# EAGLE design noroshi_LoRa_RAK (EAGLE 8.6.3)
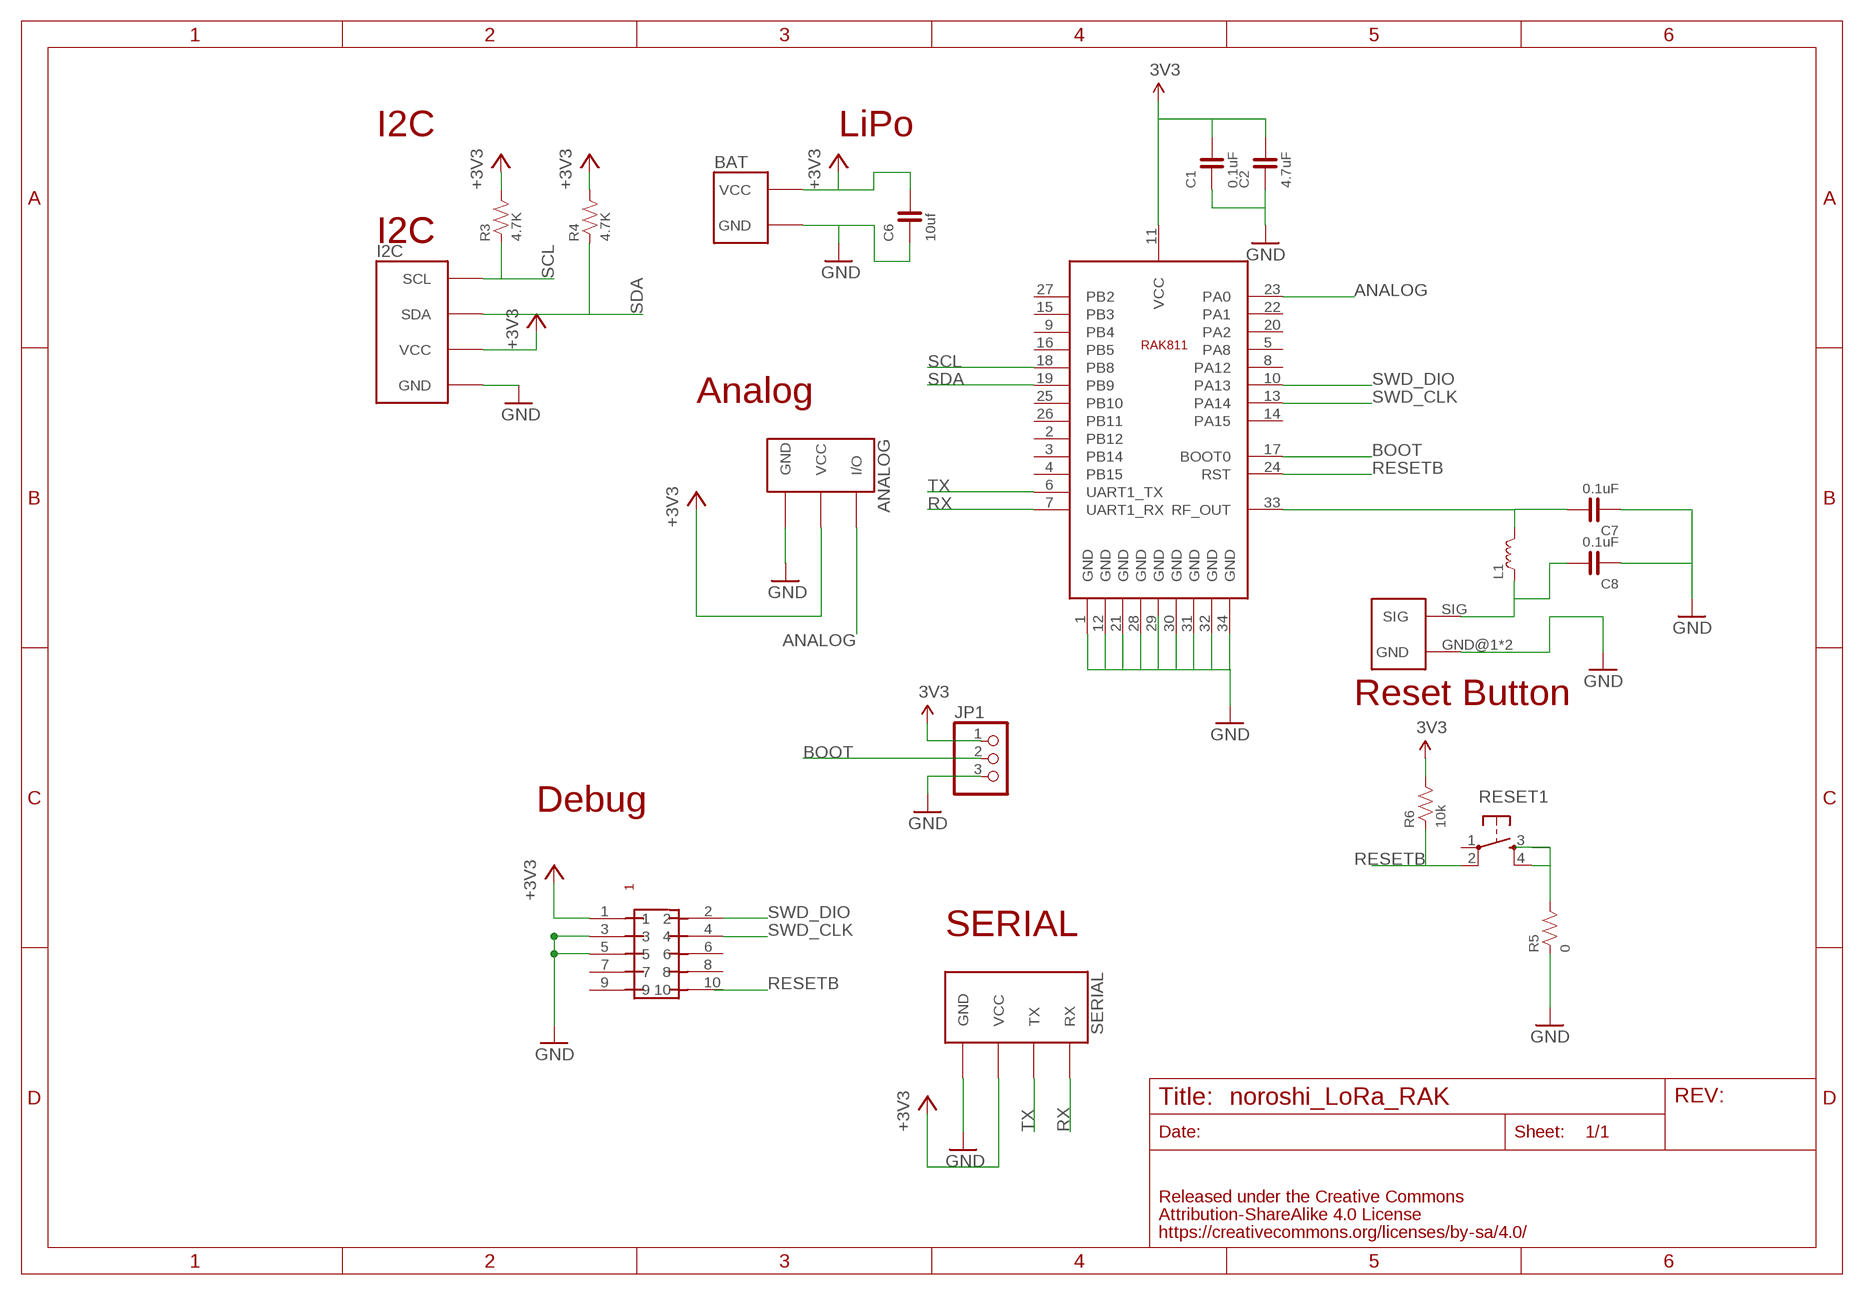
[diagram p0: schematic, sheet 1]

## Parts
ANALOG  FABO_BRICK_3PIN-S03B-PASK-2_LONG  [FABO_BRICK_3PIN_S03B-PASK-2_LONG]
BAT  FABO_BRICK_2PIN_SIDE  [FABO_BRICK_2PIN_S02B−PASK-2_SILK]
C1  0.1uF  CAPACITOR-0603_NARROW  [0603-NARROW]
C2  4.7uF  CAPACITOR-0603_NARROW  [0603-NARROW]
C6  10uf  CAPACITOR-0603  [0603]
C7  0.1uF  CAPACITOR-0603_NARROW  [0603-NARROW]
C8  0.1uF  CAPACITOR-0603_NARROW  [0603-NARROW]
I2C  FABO_BRICK_I2C-S04B-PASK-2_LONG  [FABO_BRICK_I2C_S04B-PASK-2_LONG]
JP1  PINHD-1X3  [1X03]
L1  COIL-0603  [0603]
R3  4.7K  RESISTOR-0603  [0603]
R4  4.7K  RESISTOR-0603  [0603]
R5  0  RESISTOR-0603-NARROW  [0603-NARROW]
R6  10k  RESISTOR-0603-NARROW  [0603-NARROW]
RESET1  TACT-SWITCH-SMD_KMR2  [KMR2]
SERIAL  FABO_BRICK_SERIAL-S04B-PASK-2_LONG  [FABO_BRICK_SERIAL_S04B-PASK-2_LONG]
U$2  RAK811  [RAK811]
U$8  PIN-HEADER-SMT(1.27MM)2X5  [PIN-HEADER-SMT(1.27MM)2X5]
UF1  HIROSE-U.FL  [HIROSE-UF.L]

## Nets
3V3: C1.2 C2.2 JP1.1 R6.2 U$2.11(VCC)
+3V3: ANALOG.VCC BAT.VCC C6.2 I2C.VCC R3.2 R4.2 SERIAL.VCC U$8.1
ANALOG: ANALOG.I/O U$2.23(PA0)
BOOT: JP1.2 U$2.17(BOOT0)
GND: ANALOG.GND BAT.GND C1.1 C2.1 C6.1 C7.1 C8.1 I2C.GND JP1.3 R5.1 SERIAL.GND U$2.1(GND) U$2.12(GND) U$2.21(GND) U$2.28(GND) U$2.30(GND) U$2.31(GND) U$2.32(GND) U$2.34(GND) U$8.3 U$8.5 UF1.GND@1(GND) UF1.GND@2(GND)
N$2: C7.2 L1.2 U$2.33(RF_OUT)
N$3: C8.2 L1.1 UF1.SIG
N$10: R5.2 RESET1.3 RESET1.4
RESETB: R6.1 RESET1.2 U$2.24(RST) U$8.10
RX: SERIAL.RX U$2.7(UART1_RX)
SCL: I2C.SCL R3.1 U$2.18(PB8)
SDA: I2C.SDA R4.1 U$2.19(PB9)
SWD_CLK: U$2.13(PA14) U$8.4
SWD_DIO: U$2.10(PA13) U$8.2
TX: SERIAL.TX U$2.6(UART1_TX)
Unconnected: RESET1.1 U$2.2(PB12) U$2.3(PB14) U$2.4(PB15) U$2.5(PA8) U$2.8(PA12) U$2.9(PB4) U$2.14(PA15) U$2.15(PB3) U$2.16(PB5) U$2.20(PA2) U$2.22(PA1) U$2.25(PB10) U$2.26(PB11) U$2.27(PB2) U$2.29(GND) U$8.6 U$8.7 U$8.8 U$8.9

## Notes on the sheet
- I2C | LiPo
- I2C | I2C
- Analog
- Reset Button
- Debug
- SERIAL

## Library data of the parts
ANALOG = FaBo-Template:FABO_BRICK_3PIN: FaBo Brick 3pin
BAT = FaBo-Template:FABO_BRICK_2PIN
C1 C2 C6-C8 = FaBo-Capacitor:CAPACITOR: CAPACITOR
I2C = FaBo-Template:FABO_BRICK_I2C: FaBo Brick I2C
JP1 = adafruit:PINHD-1X3: PIN HEADER
L1 = FaBo-Coil:COIL: RESISTOR
R3-R6 = FaBo-Resistors:RESISTOR: RESISTOR
RESET1 = FaBo-Switch:TACT-SWITCH
SERIAL = FaBo-Template:FABO_BRICK_SERIAL: FaBo Brick Serial
U$2 = FaBo-LoRa:RAK811
U$8 = gclue:PIN-HEADER-SMT(1.27MM)2X5: PIN-HEADER-SMT (1.27MM) 2x5
UF1 = FaBo-Connetor:HIROSE-U.FL

## Board
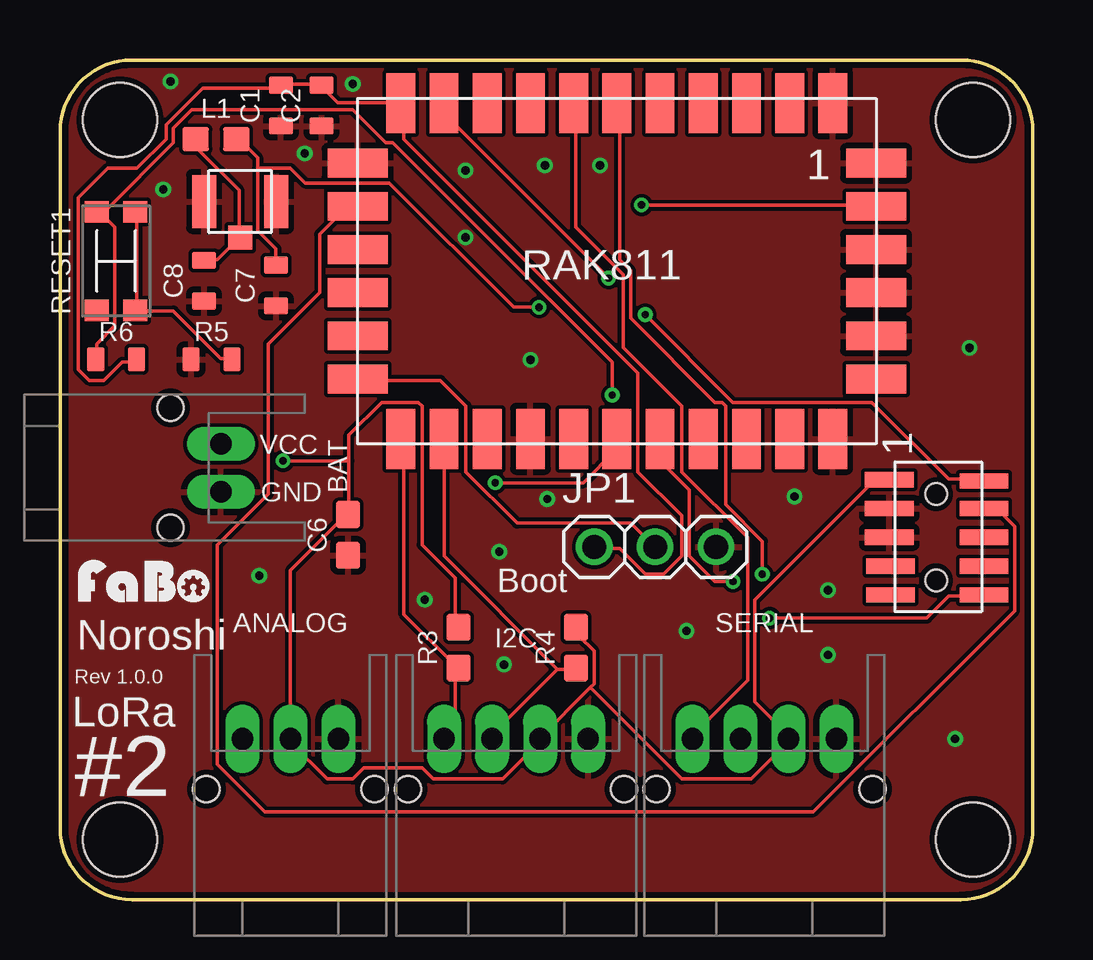
[diagram p1: board, top side]
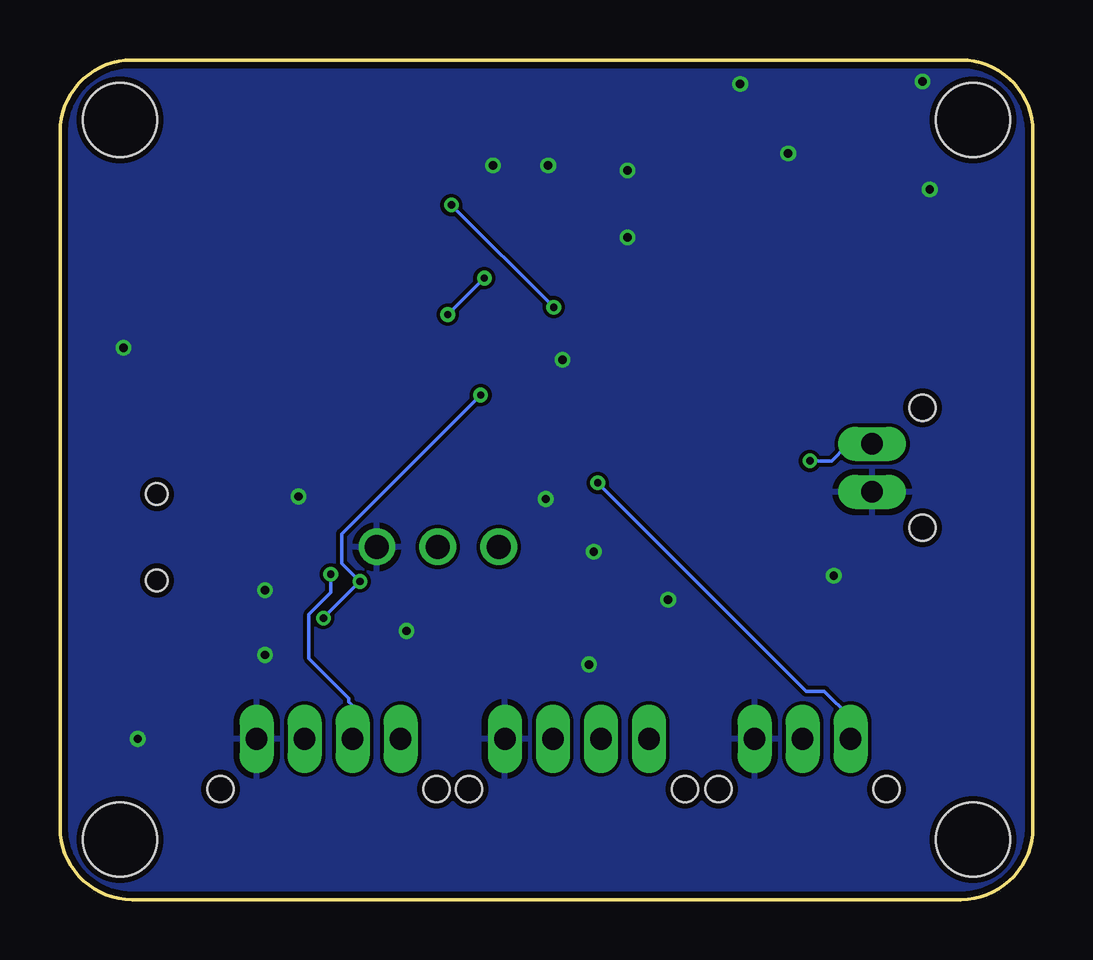
[diagram p2: board, bottom side, seen from below]

Size 40.54 x 35 mm. Coordinates in mm from the lower left corner, seen from the top.
Copper layers (1*16): Top 0.035mm / dielectric 1.5mm / Bottom 0.035mm
Design rules "SeeedStudio_2layer_DRU_no_angle_20140221": minimum track width 6mil, minimum drill 12mil, track to track 6mil, track to pad 6mil, pad to pad 6mil, via to via 6mil, smd to smd 0mil, copper to edge 10mil, drill to drill 10mil, minimum pad ring 10mil, minimum via ring 6mil, stop-mask expansion 2mil, vias tented up to drill 100mil, thermal gap 10mil

### Footprints (pad centres in the part's own frame; a part is rotated, then mirrored left to right if it is on the bottom)
FABO_BRICK_3PIN_S03B-PASK-2_LONG = drill 0.9 pad 1.422 long: GND -2,0; I/O 2,0; VCC 0,0 | hole 1.1: 3.5,2.1; -3.5,2.1
FABO_BRICK_2PIN_S02B−PASK-2_SILK = drill 0.9 pad 1.422 long: GND -1,-0.102; VCC 1,-0.102 | hole 1.1: 2.5,1.998; -2.5,1.998
0603-NARROW = smd 0.71 x 1: 1 -0.85,0; 2 0.85,0
0603 = smd 1.1 x 1: 1 -0.85,0; 2 0.85,0
FABO_BRICK_I2C_S04B-PASK-2_LONG = drill 0.9 pad 1.422 long: GND -3,0; SCL 3,0; SDA 1,0; VCC -1,0 | hole 1.1: 4.5,2.1; -4.5,2.1
1X03 = drill 1.016: 1 -2.54,0; 2 0,0; 3 2.54,0
KMR2 = smd 0.9 x 1: 1 -2.05,0.8; 2 2.05,0.8; 3 2.05,-0.8; 4 -2.05,-0.8
FABO_BRICK_SERIAL_S04B-PASK-2_LONG = drill 0.9 pad 1.422 long: GND -3,0; RX 3,0; TX 1,0; VCC -1,0 | hole 1.1: 4.5,2.1; -4.5,2.1
FABO-SHINOBI = hole 3.1: 2.5,32.5; 38.04,32.5; 38.04,2.5; 2.5,2.5
RAK811 = smd 1.2 x 2.5: 1 -9,-7; 2 -7.2,-7; 3 -5.4,-7; 4 -3.6,-7; 5 -1.8,-7; 6 0,-7; 7 1.8,-7; 8 3.6,-7; 9 5.4,-7; 10 7.2,-7; 11 9,-7; 18 9,7; 19 7.2,7; 20 5.4,7; 21 3.6,7; 22 1.8,7; 23 0,7; 24 -1.8,7; 25 -3.6,7; 26 -5.4,7; 27 -7.2,7; 28 -9,7 | smd 2.5 x 1.2: 12 10.8,-4.5; 13 10.8,-2.7; 14 10.8,-0.9; 15 10.8,0.9; 16 10.8,2.7; 17 10.8,4.5; 29 -10.8,4.5; 30 -10.8,2.7; 31 -10.8,0.9; 32 -10.8,-0.9; 33 -10.8,-2.7; 34 -10.8,-4.5
PIN-HEADER-SMT(1.27MM)2X5 = smd 0.635 x 2.032: 1 -2.4,-1.95; 2 -2.35,2; 3 -1.2,-1.95; 4 -1.2,2; 5 0,-1.95; 6 0,2; 7 1.2,-1.9; 8 1.2,2; 9 2.4,-1.9; 10 2.4,2 | hole 0.9: 1.8,0; -1.8,0
HIROSE-UF.L = smd 1 x 2.2: GND@1 -1.5,0; GND@2 1.5,0 | smd 1 x 1: SIG 0,-1.5

### Placement (x,y rotation side)
ANALOG  9.6,6.7 180 top
BAT  6.6,18 90 top
C1  9.2,33.1 90 top
C2  10.9,33.1 90 top
C6  12,15.2 90 top
C7  9,25.6 90 top
C8  6,25.8 90 top
I2C  19,6.7 180 top
JP1  24.8,14.7 0 top
L1  6.5,31.7 0 top
R3  16.6,10.5 90 top
R4  21.5,10.5 90 top
R5  6.31,22.52 0 top
R6  2.34,22.52 0 top
RESET1  2.34,26.62 90 top
SERIAL  29.35,6.7 180 top
U$1  [FABO-SHINOBI]  0,0 0 top
U$2  23.2,26.2 180 top
U$3  [LOGO_FABO_S]  3.55,12.25 0 top
U$8  36.5,15.1 270 top
UF1  7.5,29.1 0 top

### Tracks (layer width: path | path; a pad name or v marks a point on that pad's centre or on a via)
3V3
  Top 0.152: R6.2 3.05,22.4 2.59,22.4 1.83,21.64 1.22,21.64 0.76,22.1 0.76,29.26 1.98,30.48 3.2,30.48 4.42,31.7 4.42,32.31 5.94,33.83 9.14,33.83 C1.2 9.3,33.98 10.82,33.98 C2.2 10.97,33.83 11.58,33.22 14.17,33.22 U$2.11 14.33,33.07 14.33,31.7 24.08,21.95 24.08,17.83 25.91,16 25.91,14.33 25.15,13.56 24.38,13.56 23.32,14.63 22.4,14.63 JP1.1
+3V3  (via drill 0.3)
  Top 0.152: 12.04,18.29 12.04,16.15 C6.2 11.89,16 9.6,13.72 ANALOG.VCC 9.6,6.55 11.12,5.03 12.19,5.03 12.65,5.49 15.09,5.49 15.54,5.03 18.44,5.03 19.96,6.55 I2C.VCC 19.96,6.71 22.1,8.84 | 12.04,18.29 12.04,19.36 13.41,20.73 14.94,20.73 15.09,20.57 15.09,14.78 16.46,13.41 16.46,11.43 R3.2 | 12.04,18.29 v9.3,18.29 | 22.1,8.84 22.25,8.99 22.25,10.36 21.64,10.97 21.64,11.28 R4.2 | U$8.1 34.44,17.37 33.83,17.37 28.96,12.5 28.96,8.23 30.48,6.71 SERIAL.VCC 30.33,6.55 28.8,5.03 25.91,5.03 22.1,8.84
  Bottom 0.152: v9.3,18.29 8.38,18.29 7.77,18.9 6.71,18.9 BAT.VCC
ANALOG  (via drill 0.3)
  Top 0.152: v18.14,17.37 21.79,17.37 23.16,18.75 23.16,19.05 U$2.23
  Bottom 0.152: v18.14,17.37 9.45,8.69 8.69,8.69 7.62,7.62 7.62,6.71 ANALOG.I/O
BOOT
  Top 0.152: U$2.17 12.5,21.64 15.85,21.64 16.92,20.57 16.92,17.83 19.05,15.7 23.77,15.7 24.69,14.78 JP1.2
GND  (via drill 0.35)
  other vias: 8.3,13.5 18.3,14.5 20.3,16.7 20.2,30.6 22.5,30.6 16.9,30.4 12.2,34 4.6,34.1 26.1,11.2 19.6,22.5 18.5,9.8 15.2,12.5 37.9,23 32,12.9 32,10.2 37.3,6.7 30.6,16.8 4.3,29.6 10.2,31.1 16.9,27.6
  pour Bottom: 0,0 0,35.56 40.64,35.56 40.64,0
  pour Top: -0.1,-0.1 -0.1,35.56 40.64,35.56 40.64,0 0,0
N$2  (via drill 0.3)
  Top 0.152: 8.23,30.48 8.23,30.94 7.47,31.7 L1.2 | 8.23,30.48 8.23,27.89 8.99,27.13 8.99,26.52 C7.2 | v24.23,28.96 33.98,28.96 U$2.33 | v19.96,24.69 18.9,24.69 13.72,29.87 10.21,29.87 9.6,30.48 8.23,30.48
  Bottom 0.152: v19.96,24.69 v24.23,28.96
N$3
  Top 0.152: C8.2 6.1,26.67 6.55,26.67 7.47,27.58 UF1.SIG 7.47,27.74 7.47,29.57 5.79,31.24 5.79,31.7 L1.1
N$10
  Top 0.152: RESET1.3 3.2,28.65 3.2,24.69 RESET1.4 3.2,24.54 4.72,24.54 6.71,22.55 7.01,22.55 R5.2
RESETB  (via drill 0.3)
  Top 0.152: R6.1 1.52,22.55 1.52,23.16 2.29,23.93 2.29,28.04 1.68,28.65 RESET1.2 1.68,28.8 1.98,28.8 4.72,31.55 4.72,32.16 5.49,32.92 12.19,32.92 13.56,31.55 13.87,31.55 23.01,22.4 v23.01,21.03 | v29.57,11.73 36.12,11.73 37.03,12.65 38.41,12.65 U$8.10 | v28.04,13.26 27.28,13.26 26.21,14.33 26.21,17.07 25.15,18.14 25.15,19.05 U$2.24
  Bottom 0.152: v29.57,11.73 v28.04,13.26 28.8,14.02 28.8,15.24 v23.01,21.03
RX
  Top 0.152: U$2.7 21.49,33.07 21.49,28.04 23.47,26.06 23.47,23.01 25.91,20.57 25.91,17.83 28.65,15.09 28.65,9.14 26.21,6.71 SERIAL.RX
SCL
  Top 0.152: I2C.SCL 16.46,7.16 16.46,9.6 R3.1 16.46,9.75 14.33,11.89 14.33,19.05 U$2.18
SDA
  Top 0.152: 20.73,9.6 21.49,9.6 R4.1 | 20.73,9.6 18.14,7.01 18.14,6.71 I2C.SDA | 20.73,9.6 16,14.33 16,19.05 U$2.19
SWD_CLK
  Top 0.152: U$8.4 38.56,16.15 39.17,16.15 39.78,15.54 39.78,12.04 31.39,3.66 8.53,3.66 6.55,5.64 6.55,14.78 8.69,16.92 8.69,23.16 10.82,25.3 10.82,27.74 11.89,28.8 12.34,28.8 U$2.13
SWD_DIO  (via drill 0.3)
  Top 0.152: v24.38,24.38 28.04,20.73 33.83,20.73 37.03,17.53 38.41,17.53 U$8.2 | v22.86,25.91 16,32.77 16,33.07 U$2.10
  Bottom 0.152: v22.86,25.91 v24.38,24.38
TX  (via drill 0.3)
  Top 0.152: v29.26,13.56 29.26,14.94 27.74,16.46 27.74,20.57 27.58,20.73 27.28,20.73 23.77,24.23 23.77,26.21 23.32,26.67 23.32,33.07 U$2.6
  Bottom 0.152: v29.26,13.56 29.26,12.8 30.18,11.89 30.18,10.06 28.5,8.38 28.5,8.23 28.35,8.08 SERIAL.TX

### Text on the board
tPlace: Boot | Noroshi | Rev 1.0.0 | LoRa | #2